# Altium schematic sheet connector.SchDoc
size A
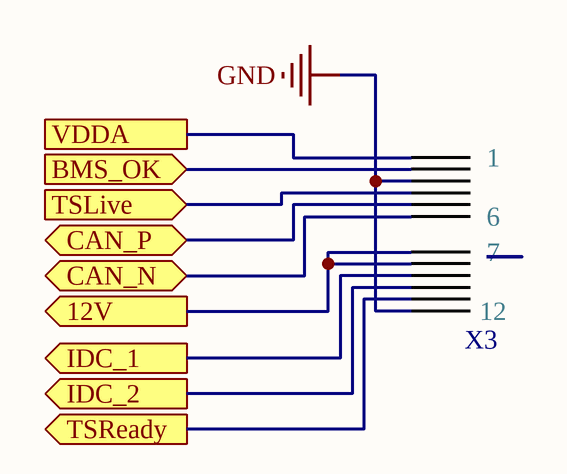
[diagram p0: connector.SchDoc]

## Parts
X3  4-794619-2  [4-794619-2]  (value not drawn)

## Ports
12V (out), BMS_OK (in), CAN_N (bidir), CAN_P (bidir), IDC_1 (out), IDC_2 (out), TSLive (in), TSReady (out), VDDA

## Nets
GND: X3.3 X3.12
12V: X3.7 X3.8 ; port 12V
BMS_OK: X3.2 ; port BMS_OK
CAN_N: X3.6 ; port CAN_N
CAN_P: X3.5 ; port CAN_P
IDC_1: X3.9 ; port IDC_1
IDC_2: X3.10 ; port IDC_2
TSLive: X3.4 ; port TSLive
TSReady: X3.11 ; port TSReady
VDDA: X3.1 ; port VDDA

## Library data of the parts
X3 = 41: 12p te; id: 41; numcontacts: 12; numrows: 2; pitch: 3mm; name: 4-794619-2; quantity: 0; link: https://www.digikey.com/product-detail/en/te-connectivity-amp-connectors/4-794619-2/A115204-ND/2286935